# EAGLE design mcb-enhancer-v5 (EAGLE 7.2.0)
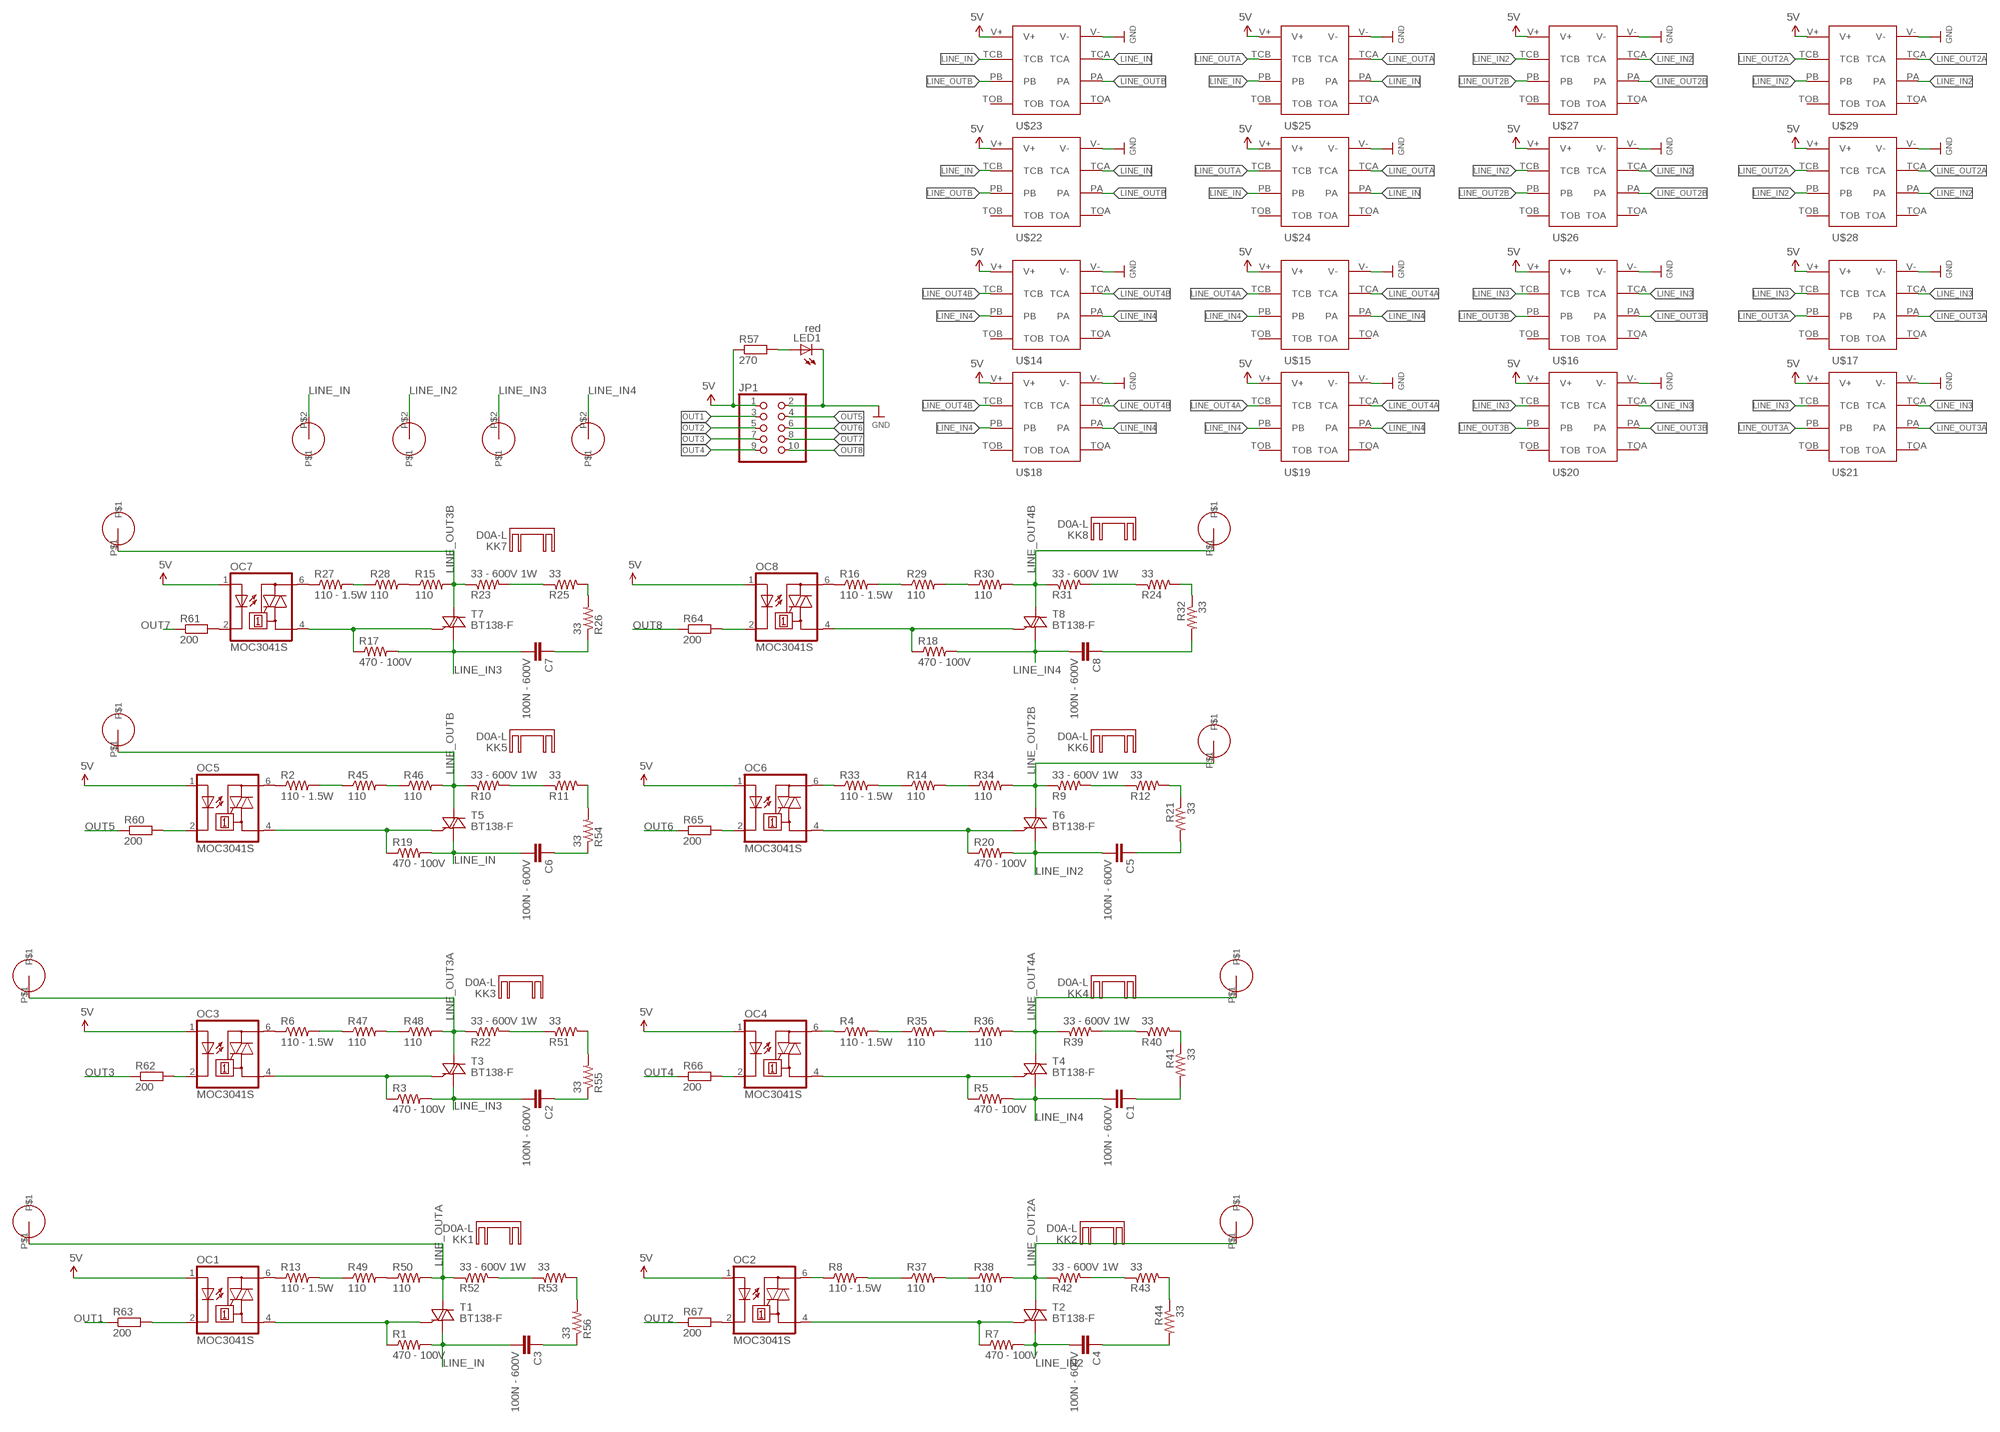
[diagram p0: schematic, sheet 1]

## Parts
C1  100N - 600V  C-EUC1210  [C1210]
C2  100N - 600V  C-EUC1210  [C1210]
C3  100N - 600V  C-EUC1210  [C1210]
C4  100N - 600V  C-EUC1210  [C1210]
C5  100N - 600V  C-EUC1210  [C1210]
C6  100N - 600V  C-EUC1210  [C1210]
C7  100N - 600V  C-EUC1210  [C1210]
C8  100N - 600V  C-EUC1210  [C1210]
JP1  PINHD-2X5  [2X05]
KK1  D0A-L  [D02A-L]
KK2  D0A-L  [D02A-L]
KK3  D0A-L  [D02A-L]
KK4  D0A-L  [D02A-L]
KK5  D0A-L  [D02A-L]
KK6  D0A-L  [D02A-L]
KK7  D0A-L  [D02A-L]
KK8  D0A-L  [D02A-L]
LED1  red  LEDCHIP-LED0805  [CHIP-LED0805]
OC1  MOC3041S  [DIL6-SMD]
OC2  MOC3041S  [DIL6-SMD]
OC3  MOC3041S  [DIL6-SMD]
OC4  MOC3041S  [DIL6-SMD]
OC5  MOC3041S  [DIL6-SMD]
OC6  MOC3041S  [DIL6-SMD]
OC7  MOC3041S  [DIL6-SMD]
OC8  MOC3041S  [DIL6-SMD]
R1  470 - 100V  R-US_R1206  [R1206]
R2  110 - 1.5W  R-US_R2512  [R2512]
R3  470 - 100V  R-US_R1206  [R1206]
R4  110 - 1.5W  R-US_R2512  [R2512]
R5  470 - 100V  R-US_R1206  [R1206]
R6  110 - 1.5W  R-US_R2512  [R2512]
R7  470 - 100V  R-US_R1206  [R1206]
R8  110 - 1.5W  R-US_R2512  [R2512]
R9  33 - 600V 1W  R-US_R1206  [R1206]
R10  33 - 600V 1W  R-US_R1206  [R1206]
R11  33  R-US_R1206  [R1206]
R12  33  R-US_R1206  [R1206]
R13  110 - 1.5W  R-US_R2512  [R2512]
R14  110  R-US_R2512  [R2512]
R15  110  R-US_R2512  [R2512]
R16  110 - 1.5W  R-US_R2512  [R2512]
R17  470 - 100V  R-US_R1206  [R1206]
R18  470 - 100V  R-US_R1206  [R1206]
R19  470 - 100V  R-US_R1206  [R1206]
R20  470 - 100V  R-US_R1206  [R1206]
R21  33  R-US_R1206  [R1206]
R22  33 - 600V 1W  R-US_R1206  [R1206]
R23  33 - 600V 1W  R-US_R1206  [R1206]
R24  33  R-US_R1206  [R1206]
R25  33  R-US_R1206  [R1206]
R26  33  R-US_R1206  [R1206]
R27  110 - 1.5W  R-US_R2512  [R2512]
R28  110  R-US_R2512  [R2512]
R29  110  R-US_R2512  [R2512]
R30  110  R-US_R2512  [R2512]
R31  33 - 600V 1W  R-US_R1206  [R1206]
R32  33  R-US_R1206  [R1206]
R33  110 - 1.5W  R-US_R2512  [R2512]
R34  110  R-US_R2512  [R2512]
R35  110  R-US_R2512  [R2512]
R36  110  R-US_R2512  [R2512]
R37  110  R-US_R2512  [R2512]
R38  110  R-US_R2512  [R2512]
R39  33 - 600V 1W  R-US_R1206  [R1206]
R40  33  R-US_R1206  [R1206]
R41  33  R-US_R1206  [R1206]
R42  33 - 600V 1W  R-US_R1206  [R1206]
R43  33  R-US_R1206  [R1206]
R44  33  R-US_R1206  [R1206]
R45  110  R-US_R2512  [R2512]
R46  110  R-US_R2512  [R2512]
R47  110  R-US_R2512  [R2512]
R48  110  R-US_R2512  [R2512]
R49  110  R-US_R2512  [R2512]
R50  110  R-US_R2512  [R2512]
R51  33  R-US_R1206  [R1206]
R52  33 - 600V 1W  R-US_R1206  [R1206]
R53  33  R-US_R1206  [R1206]
R54  33  R-US_R1206  [R1206]
R55  33  R-US_R1206  [R1206]
R56  33  R-US_R1206  [R1206]
R57  270  R-EU_R0402  [R0402]
R60  200  R-EU_R0603  [R0603]
R61  200  R-EU_R0603  [R0603]
R62  200  R-EU_R0603  [R0603]
R63  200  R-EU_R0603  [R0603]
R64  200  R-EU_R0603  [R0603]
R65  200  R-EU_R0603  [R0603]
R66  200  R-EU_R0603  [R0603]
R67  200  R-EU_R0603  [R0603]
T1  BT138-F  [TO220BF]
T2  BT138-F  [TO220BF]
T3  BT138-F  [TO220BF]
T4  BT138-F  [TO220BF]
T5  BT138-F  [TO220BF]
T6  BT138-F  [TO220BF]
T7  BT138-F  [TO220BF]
T8  BT138-F  [TO220BF]
U$1  CONN-SCREW-MINI  [CONN-SCREW-MINI]
U$2  CONN-SCREW-MINI  [CONN-SCREW-MINI]
U$3  CONN-SCREW-MINI  [CONN-SCREW-MINI]
U$4  CONN-SCREW-MINI  [CONN-SCREW-MINI]
U$5  CONN-SCREW-MINI  [CONN-SCREW-MINI]
U$6  CONN-SCREW-MINI  [CONN-SCREW-MINI]
U$7  CONN-SCREW-MINI  [CONN-SCREW-MINI]
U$8  CONN-SCREW-MINI  [CONN-SCREW-MINI]
U$9  CONN  [HC617]
U$10  CONN  [HC617]
U$11  CONN  [HC617]
U$12  CONN  [HC617]
U$14  9-1462038-9  [TE-9-1462038-9]
U$15  9-1462038-9  [TE-9-1462038-9]
U$16  9-1462038-9  [TE-9-1462038-9]
U$17  9-1462038-9  [TE-9-1462038-9]
U$18  9-1462038-9  [TE-9-1462038-9]
U$19  9-1462038-9  [TE-9-1462038-9]
U$20  9-1462038-9  [TE-9-1462038-9]
U$21  9-1462038-9  [TE-9-1462038-9]
U$22  9-1462038-9  [TE-9-1462038-9]
U$23  9-1462038-9  [TE-9-1462038-9]
U$24  9-1462038-9  [TE-9-1462038-9]
U$25  9-1462038-9  [TE-9-1462038-9]
U$26  9-1462038-9  [TE-9-1462038-9]
U$27  9-1462038-9  [TE-9-1462038-9]
U$28  9-1462038-9  [TE-9-1462038-9]
U$29  9-1462038-9  [TE-9-1462038-9]

## Nets
5V: JP1.1 OC1.1(A) OC2.1(A) OC3.1(A) OC4.1(A) OC5.1(A) OC6.1(A) OC7.1(A) OC8.1(A) R57.1 U$14.V+ U$15.V+ U$16.V+ U$17.V+ U$18.V+ U$19.V+ U$20.V+ U$21.V+ U$22.V+ U$23.V+ U$24.V+ U$25.V+ U$26.V+ U$27.V+ U$28.V+ U$29.V+
GND: JP1.2 LED1.C U$14.V- U$15.V- U$16.V- U$17.V- U$18.V- U$19.V- U$20.V- U$21.V- U$22.V- U$23.V- U$24.V- U$25.V- U$26.V- U$27.V- U$28.V- U$29.V-
LINE_IN: C3.2 C6.2 R1.2 R19.2 T1.T1(A1) T5.T1(A1) U$9.P$2 U$22.TCA U$22.TCB U$23.TCA U$23.TCB U$24.PA U$24.PB U$25.PA U$25.PB
LINE_IN2: C4.2 C5.2 R7.2 R20.2 T2.T1(A1) T6.T1(A1) U$10.P$2 U$26.TCA U$26.TCB U$27.TCA U$27.TCB U$28.PA U$28.PB U$29.PA U$29.PB
LINE_IN3: C2.2 C7.2 R3.2 R17.2 T3.T1(A1) T7.T1(A1) U$11.P$2 U$16.TCA U$16.TCB U$17.TCA U$17.TCB U$20.TCA U$20.TCB U$21.TCA U$21.TCB
LINE_IN4: C1.2 C8.2 R5.2 R18.2 T4.T1(A1) T8.T1(A1) U$12.P$2 U$14.PA U$14.PB U$15.PA U$15.PB U$18.PA U$18.PB U$19.PA U$19.PB
LINE_OUT2A: R38.2 R42.1 T2.T2(A2) U$2.P$1 U$28.TCA U$28.TCB U$29.TCA U$29.TCB
LINE_OUT2B: R9.1 R34.2 T6.T2(A2) U$6.P$1 U$26.PA U$26.PB U$27.PA U$27.PB
LINE_OUT3A: R22.1 R48.2 T3.T2(A2) U$3.P$1 U$17.PA U$17.PB U$21.PA U$21.PB
LINE_OUT3B: R15.2 R23.1 T7.T2(A2) U$7.P$1 U$16.PA U$16.PB U$20.PA U$20.PB
LINE_OUT4A: R36.2 R39.1 T4.T2(A2) U$4.P$1 U$15.TCA U$15.TCB U$19.TCA U$19.TCB
LINE_OUT4B: R30.2 R31.1 T8.T2(A2) U$8.P$1 U$14.TCA U$14.TCB U$18.TCA U$18.TCB
LINE_OUTA: R50.2 R52.1 T1.T2(A2) U$1.P$1 U$24.TCA U$24.TCB U$25.TCA U$25.TCB
LINE_OUTB: R10.1 R46.2 T5.T2(A2) U$5.P$1 U$22.PA U$22.PB U$23.PA U$23.PB
N$1: OC5.6(A2) R2.1
N$2: OC2.6(A2) R8.1
N$3: OC3.4(A1) R3.1 T3.G
N$4: OC3.6(A2) R6.1
N$5: OC4.4(A1) R5.1 T4.G
N$6: OC1.2(C) R63.2
N$7: R9.2 R12.1
N$8: R49.2 R50.1
N$9: R52.2 R53.1
N$10: OC1.6(A2) R13.1
N$11: OC1.4(A1) R1.1 T1.G
N$12: R8.2 R37.1
N$13: OC2.4(A1) R7.1 T2.G
N$14: R45.2 R46.1
N$15: OC2.2(C) R67.2
N$16: R23.2 R25.1
N$17: R25.2 R26.2
N$18: OC3.2(C) R62.2
N$19: OC4.2(C) R66.2
N$20: C7.1 R26.1
N$21: R12.2 R21.1
N$22: OC7.2(C) R61.2
N$23: OC7.6(A2) R27.1
N$24: OC8.2(C) R64.2
N$25: R15.1 R28.2
N$26: R27.2 R28.1
N$27: OC5.2(C) R60.2
N$28: OC6.2(C) R65.2
N$29: R16.2 R29.1
N$30: OC7.4(A1) R17.1 T7.G
N$31: OC8.6(A2) R16.1
N$32: OC8.4(A1) R18.1 T8.G
N$33: R29.2 R30.1
N$34: R37.2 R38.1
N$35: OC5.4(A1) R19.1 T5.G
N$36: OC6.4(A1) R20.1 T6.G
N$37: C5.1 R21.2
N$38: OC4.6(A2) R4.1
N$39: C8.1 R32.2
N$40: R24.2 R32.1
N$41: R24.1 R31.2
N$42: R4.2 R35.1
N$43: R35.2 R36.1
N$44: OC6.6(A2) R33.1
N$45: R14.1 R33.2
N$46: R14.2 R34.1
N$47: R39.2 R40.1
N$48: C1.1 R41.2
N$49: R40.2 R41.1
N$50: C4.1 R44.2
N$51: R43.2 R44.1
N$52: R42.2 R43.1
N$53: R47.2 R48.1
N$54: R13.2 R49.1
N$55: R6.2 R47.1
N$56: R2.2 R45.1
N$57: R22.2 R51.1
N$58: R10.2 R11.1
N$59: C3.1 R56.1
N$60: R53.2 R56.2
N$61: C2.1 R55.1
N$62: R51.2 R55.2
N$63: C6.1 R54.1
N$64: R11.2 R54.2
N$65: LED1.A R57.2
OUT1: JP1.3 R63.1
OUT2: JP1.5 R67.1
OUT3: JP1.7 R62.1
OUT4: JP1.9 R66.1
OUT5: JP1.4 R60.1
OUT6: JP1.6 R65.1
OUT7: JP1.8 R61.1
OUT8: JP1.10 R64.1
Unconnected: U$14.TOA U$14.TOB U$15.TOA U$15.TOB U$16.TOA U$16.TOB U$17.TOA U$17.TOB U$18.TOA U$18.TOB U$19.TOA U$19.TOB U$20.TOA U$20.TOB U$21.TOA U$21.TOB U$22.TOA U$22.TOB U$23.TOA U$23.TOB U$24.TOA U$24.TOB U$25.TOA U$25.TOB U$26.TOA U$26.TOB U$27.TOA U$27.TOB U$28.TOA U$28.TOB U$29.TOA U$29.TOB

## Library data of the parts
C1-C8 = rcl:C-EU: CAPACITOR, European symbol
JP1 = pinhead:PINHD-2X5: PIN HEADER
KK1-KK8 = heatsink:D0A-L: HEATSINK distributor Schukat
LED1 = adafruit:LED: LED OSRAM: - CHIPLED LG R971, LG N971, LY N971, LG Q971, LY Q971, LO R971, LY R971 LH N974, LH R974 LS Q976, LO Q976, LY Q976 LO Q996 - Hyper CHIPLED LW Q18S LB Q993, LB Q99A, LB R99A - SideLED LS A670, LO A670, LY A670, LG A670, LP A670 LB A673, LV A673, LT A673, LW A673 LH A674 LY A675 LS A676, LA A676, LO A676, LY A676, LW A676 LS A679, LY A679, LG A679 - Hyper Micro SIDELED® LS Y876, LA Y876, LO Y876, LY Y876 LT Y87S - SmartLED LW L88C, LW L88S LB L89C, LB L89S, LG L890 LS L89K, LO L89K, LY L89K LS L896, LA L896, LO L896, LY L896 - TOPLED LS T670, LO T670, LY T670, LG T670, LP T670 LSG T670, LSP T670, LSY T670, LOP T670, LYG T670 LG T671, LOG T671, LSG T671 LB T673, LV T673, LT T673, LW T673 LH T674 LS T676, LA T676, LO T676, LY T676, LB T676, LH T676, LSB T676, LW T676 LB T67C, LV T67C, LT T67C, LS T67K, LO T67K, LY T67K, LW E67C LS E67B, LA E67B, LO E67B, LY E67B, LB E67C, LV E67C, LT E67C LW T67C LS T679, LY T679, LG T679 LS T770, LO T770, LY T770, LG T770, LP T770 LB T773, LV T773, LT T773, LW T773 LH T774 LS E675, LA E675, LY E675, LS T675 LS T776, LA T776, LO T776, LY T776, LB T776 LHGB T686 LT T68C, LB T68C - Hyper Mini TOPLED® LB M676 - Mini TOPLED Santana® LG M470 LS M47K, LO M47K, LY M47K Source: http://www.osram.convergy.de/
OC1-OC8 = optocoupler:MOC30*: 6-Pin DIP Zero-Cross Optoisolators Triac Driver Output (250/400 Volt Peak) Source: http://www.fairchildsemi.com/ds/MO/MOC3043-M.pdf; MF: FAIRCHILD SEMICONDUCTOR; MPN: MOC3033S-M; OC_FARNELL: unknown; OC_NEWARK: 05C2878
R1-R56 = rcl:R-US_: RESISTOR, American symbol
R57 = resistor:R-EU_: RESISTOR, European symbol
R60-R67 = rcl:R-EU_: RESISTOR, European symbol
T1-T8 = triac:BT138: TRIAC Source: http://www.semiconductors.philips.com BT138_SERIES_2.pdf
U$1-U$8 = bontor:CONN-SCREW-MINI
U$9-U$12 = bontor:CONN
U$14-U$29 = bontor:9-1462038-9

## Board
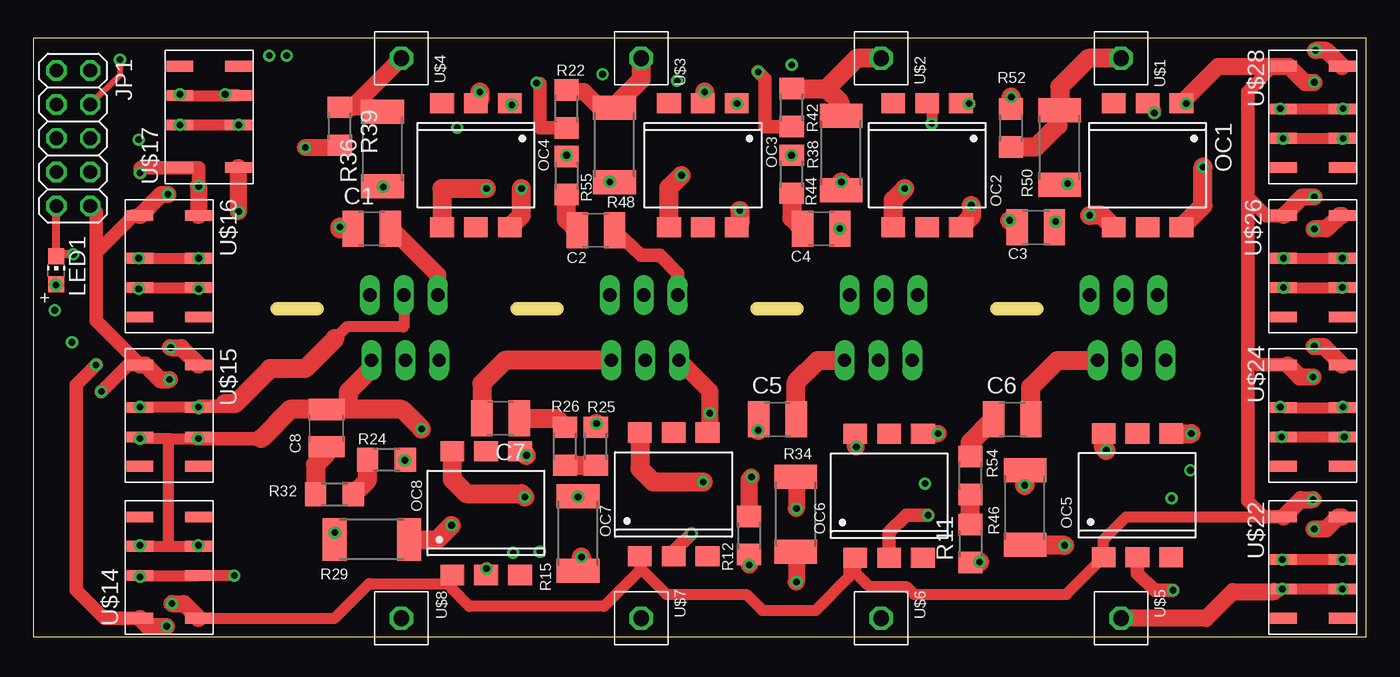
[diagram p1: board, top side]
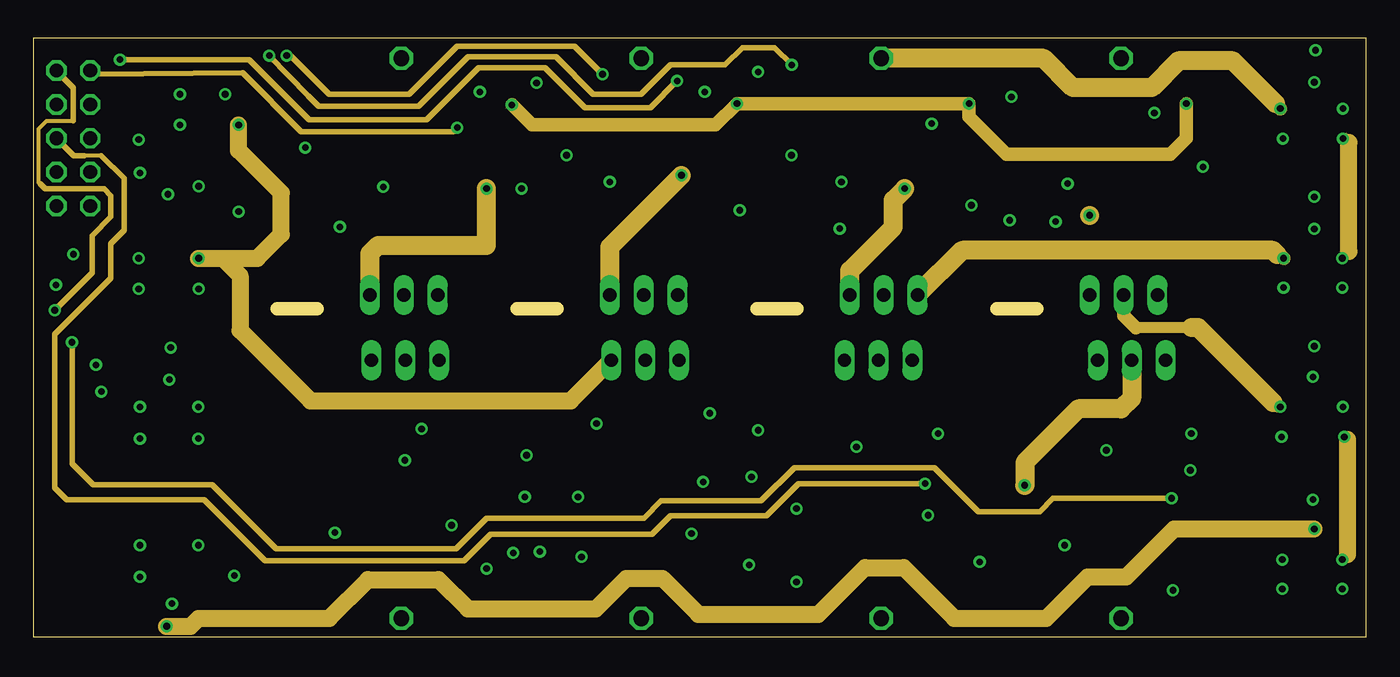
[diagram p2: board, inner layer Route2]
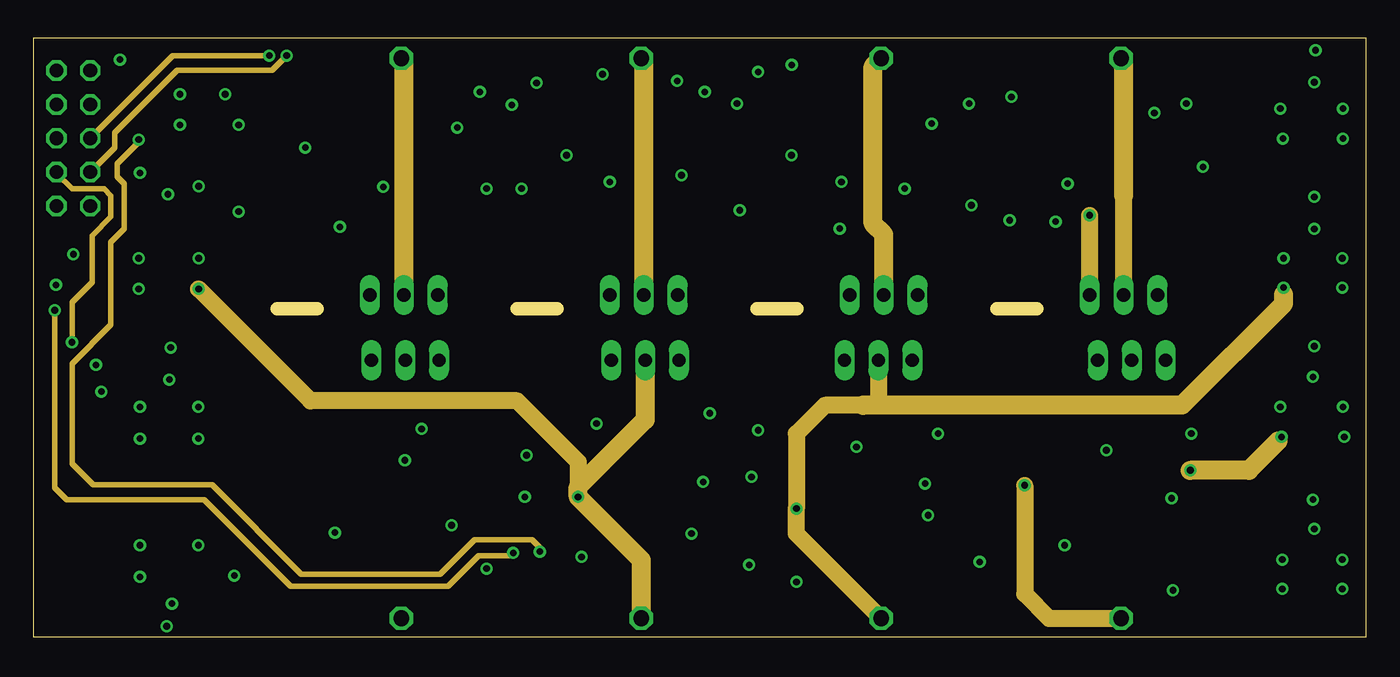
[diagram p3: board, inner layer Route15]
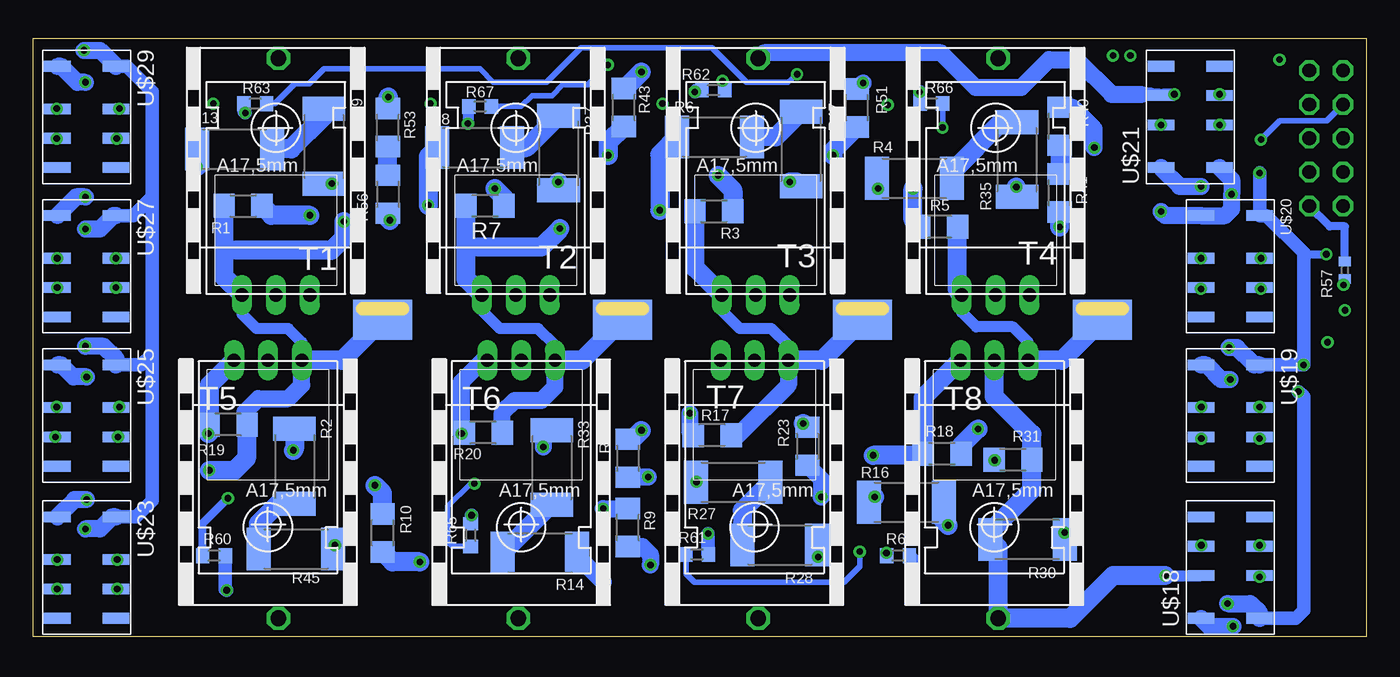
[diagram p4: board, bottom side, seen from below]

Size 100 x 44.9 mm. Coordinates in mm from the lower left corner, seen from the top.
Outline: 0,0 100,0 100,44.9 0,44.9 0,0
Copper layers (1*2+15*16): Top 0.035mm / dielectric 1.5mm / Route2 0.035mm / dielectric 0.15mm / Route15 0.035mm / dielectric 0.2mm / Bottom 0.035mm
Design rules "default *": minimum track width 10mil, minimum drill 15mil, track to track 8mil, track to pad 8mil, pad to pad 8mil, via to via 8mil, smd to smd 8mil, copper to edge 40mil, drill to drill 8mil, minimum pad ring 10mil, minimum via ring 8mil, stop-mask expansion 4mil, vias tented up to drill 0mil, thermal gap 10mil

### Footprints (pad centres in the part's own frame; a part is rotated, then mirrored left to right if it is on the bottom)
C1210 = smd 1.6 x 2.7: 1 -1.4,0; 2 1.4,0
2X05 = drill 1.016 octagon: 1 -5.08,-1.27; 2 -5.08,1.27; 3 -2.54,-1.27; 4 -2.54,1.27; 5 0,-1.27; 6 0,1.27; 7 2.54,-1.27; 8 2.54,1.27; 9 5.08,-1.27; 10 5.08,1.27
CHIP-LED0805 = smd 1.2 x 1.2: A 0,-1.05; C 0,1.05
DIL6-SMD = smd 1.78 x 1.52: 1 -2.54,-4.645; 2 0,-4.645; 3 2.54,-4.645; 4 2.54,4.645; 5 0,4.645; 6 -2.54,4.645
R1206 = smd 1.6 x 1.803: 1 -1.422,0; 2 1.422,0
R2512 = smd 1.8 x 3.2: 1 -2.8,0; 2 2.8,0
R0402 = smd 0.7 x 0.9: 1 -0.65,0; 2 0.65,0
R0603 = smd 1 x 1.1: 1 -0.85,0; 2 0.85,0
TO220BF = drill 1 pad 1.1 long: G 2.54,-1.35; T1 -2.54,-1.35; T2 0,-1.35
CONN-SCREW-MINI = drill 1.17 octagon: P$1 0,0
HC617 = smd 4.4 x 3: P$2 0,-0.8
TE-9-1462038-9 = smd 0.8 x 2: PA 1.6,2.2; PB 1.6,-2.2; TCA -0.6,2.2; TCB -0.6,-2.2; TOA 3.8,2.2; TOB 3.8,-2.2; V+ -3.8,-2.2; V- -3.8,2.2

### Placement (x,y rotation side)
C1  25.39,30.61 0 top
C2  42.2,30.51 0 top
C3  75.21,30.71 0 top
C4  59.12,30.61 0 top
C5  55.83,16.31 0 top
C6  73.44,16.31 0 top
C7  35.05,16.39 180 top
C8  21.99,15.66 90 top
JP1  3,37.4 90 top
KK1  63.8,32.7 270 bottom
KK2  81.8,32.7 270 bottom
KK3  45.8,32.7 270 bottom
KK4  27.8,32.7 270 bottom
KK5  82.4,13.9 90 bottom
KK6  63.4,13.9 90 bottom
KK7  45.9,13.9 90 bottom
KK8  27.9,13.9 90 bottom
LED1  1.7,27.5 0 top
OC1  83.59,35.38 180 top
OC2  67.06,35.38 180 top
OC3  50.23,35.38 180 top
OC4  33.2,35.38 180 top
OC5  82.83,10.62 0 top
OC6  64.21,10.59 0 top
OC7  48.04,10.69 0 top
OC8  33.97,9.29 0 top
R1  84.26,32.33 180 bottom
R2  80.4,12.8 270 bottom
R3  48.94,31.93 180 bottom
R4  33.9,34.4 0 bottom
R5  32.08,30.77 0 bottom
R6  48.9,37.5 0 bottom
R7  66.12,32.35 180 bottom
R8  66.9,36.7 0 bottom
R9  55.4,8.2 270 bottom
R10  73.8,7.8 270 bottom
R11  70.3,7 90 top
R12  53.7,7.6 90 top
R13  84.9,36.6 0 bottom
R14  62,6.3 0 bottom
R15  40.87,7.76 90 top
R16  34.5,10.1 0 bottom
R17  49.06,15.13 0 bottom
R18  31.82,13.73 0 bottom
R19  85.38,15.93 0 bottom
R20  66.24,15.33 0 bottom
R21  55.4,13.4 90 bottom
R22  40,39.6 270 top
R23  41.91,14.3 90 bottom
R24  26.5,13.3 180 top
R25  42.2,14.3 270 top
R26  39.9,14.3 270 top
R27  47.5,11.6 0 bottom
R28  44,6.9 0 bottom
R29  25.4,7.3 180 top
R30  25.4,7.3 180 bottom
R31  26.5,13.3 180 bottom
R32  22.6,10.7 180 top
R33  61.1,12.7 270 bottom
R34  57.2,9.2 90 top
R35  26.2,35.8 270 bottom
R36  26.2,36.6 90 top
R37  60.6,36.3 270 bottom
R38  60.6,36.3 90 top
R39  23,38.3 270 top
R40  23,38.3 270 bottom
R41  23,33.3 270 bottom
R42  56.9,39.7 270 top
R43  55.7,39.7 270 bottom
R44  56.9,34.7 270 top
R45  80.3,6.6 0 bottom
R46  74.4,9.7 90 top
R47  42.4,36.6 270 bottom
R48  43.6,36.9 90 top
R49  78.2,36.8 270 bottom
R50  77,36.7 90 top
R51  38.2,39.67 270 bottom
R52  73.35,38.17 90 top
R53  73.4,38.2 270 bottom
R54  70.3,12.1 270 top
R55  40,34.6 90 top
R56  73.4,33.2 90 bottom
R57  1.6,27.5 270 bottom
R60  86.44,6.09 0 bottom
R61  50.2,6.19 0 bottom
R62  48.98,41.01 180 bottom
R63  83.34,39.99 180 bottom
R64  35.12,6.09 0 bottom
R65  67.19,7.64 90 bottom
R66  32.62,40.01 180 bottom
R67  66.48,39.79 180 bottom
T1  81.8,27 0 bottom
T2  63.8,27 0 bottom
T3  45.8,27 0 bottom
T4  27.8,27 0 bottom
T5  82.4,19.4 180 bottom
T6  63.4,19.4 180 bottom
T7  45.9,19.4 180 bottom
T8  27.9,19.4 180 bottom
U$1  81.6,43.4 180 top
U$2  63.6,43.4 180 top
U$3  45.6,43.4 180 top
U$4  27.6,43.4 180 top
U$5  81.6,1.4 0 top
U$6  63.6,1.4 0 top
U$7  45.6,1.4 0 top
U$8  27.6,1.4 0 top
U$9  73.8,24.6 0 bottom
U$10  55.8,24.6 0 bottom
U$11  37.8,24.6 0 bottom
U$12  19.8,24.6 0 bottom
U$14  10.2,5.2 90 top
U$15  10.2,16.6 270 top
U$16  10.2,27.8 270 top
U$17  13.2,39 90 top
U$18  10.2,5.2 90 bottom
U$19  10.2,16.6 270 bottom
U$20  10.2,27.8 270 bottom
U$21  13.2,39 90 bottom
U$22  96,5.2 270 top
U$23  96,5.2 270 bottom
U$24  96,16.6 270 top
U$25  96,16.6 270 bottom
U$26  96,27.8 270 top
U$27  96,27.8 270 bottom
U$28  96,39 270 top
U$29  96,39 270 bottom

### Tracks (layer width: path | path; a pad name or v marks a point on that pad's centre or on a via)
5V  (via drill 0.5)
  Top 0.813: U$14.V+ 22.6,1.4 25.2,4 31.4,4 | 31.4,4 31.9,4.5 31.57,4.5 OC8.1 | 31.4,4 31.4,3.6 32.7,2.3 42.8,2.3 45.5,5 OC7.1 45.5,5.2 47.5,3.2 53.5,3.2 54.7,2 58.7,2 61.2,4.5 61.2,5.6 61.55,5.95 OC6.1 61.67,4.83 62.7,3.8 65.5,3.8 66.1,3.2 77.52,3.2 OC5.1 80.29,7.29 82,9 U$22.V+
  Top 1.016: OC1.1 86.47,40.02 v86.5,40 | v52.8,40 OC3.1 | v70.2,40 69.62,40 OC2.1 | v35.9,39.9 35.87,39.9 OC4.1 | U$28.V+ 93,42.8 91.1,40.9 91.1,33 | 91.1,33 92.5,31.6 U$26.V+ | 91.1,21.2 91.9,20.4 U$24.V+ 94.1,20.4 | 91.1,21.2 91.1,33 | U$22.V+ 92.3,9 91.1,10.2 91.1,21.2 | v5.1,18.4 7.1,20.4 U$15.V+ | U$15.V+ 7.2,20.4 | 4.7,28.8 4.7,23.7 U$15.V+ | 4.7,28.8 7.5,31.6 U$16.V+ | 4.7,28.8 4.7,31.89 JP1.1
  Top 1.27: v15.4,31.9 U$17.V+ | v10.4,2.5 11.3,2.5 U$14.V+ | U$15.V+ 8.4,20.4 9.5,19.3 v10.2,19.3 | U$16.V+ 9.6,33.2 v10.1,33.2 | v96.1,41.6 95.4,41.6 94.2,42.8 U$28.V+ 88.91,42.8 OC1.1 | U$26.V+ 95.2,33 v96.1,33 | 94.1,20.4 95,19.5 v96,19.5 | v96,10.3 95.1,10.3 U$22.V+
  Route2 1.016: v35.9,39.9 37.4,38.4 51.2,38.4 v52.8,40 v70.2,40 70.2,39 73,36.2 85.3,36.2 86.5,37.4 v86.5,40
  Bottom 0.61: R57.1 1.6,30.8 2.75,30.8 JP1.1 4.27,32.17
  Bottom 1.016: U$18.V+ 5.3,1.4 4.7,2 4.7,18 v5.1,18.4
  Bottom 1.27: U$21.V+ 10.1,34.3 v10.1,33.2 10.1,32.1 10.6,31.6 U$20.V+ 15.1,31.6 v15.4,31.9 | v10.2,19.3 10.9,19.3 12,20.4 U$19.V+ | v96.1,41.6 96.7,41.6 97.9,42.8 U$29.V+ | v96.1,33 96.8,33 U$27.V+ | v96,19.5 97,19.5 97.9,20.4 U$25.V+ | v96,10.3 96.9,10.3 U$23.V+ | v10.4,2.5 8.7,2.5 8,1.8 U$18.V+
GND  (via drill 0.5)
  Top 0.61: JP1.2 1.73,28.58 LED1.C 1.85,28.7 v3,28.7
  Top 1.016: U$14.V- 5.3,1.4 3.2,3.5 3.2,18.9 v4.7,20.4 | v8,34.8 8,35.2 U$17.V- 12.4,35.2 v12.4,33.8
  Top 1.27: v12.4,33.8 U$16.V- | U$14.V- 8.6,0.8 v10,0.8 | v10.3,21.7 11.1,21.7 U$15.V- | U$28.V- 97,44 v96.2,44 | U$26.V- 98,31.6 97,30.6 v96.1,30.6 | v96.1,21.8 96.8,21.8 U$24.V- | v96.1,8.1 97,8.1 97.9,9 U$22.V-
  Route2 1.27: v10,0.8 11.8,0.8 U$18.V- 22.2,1.4 25.1,4.3 30.4,4.3 32.6,2.1 42.2,2.1 44.5,4.4 47.2,4.4 49.9,1.7 58.9,1.7 62.4,5.2 65.3,5.2 69.1,1.4 76,1.4 79.1,4.5 82,4.5 85.6,8.1 v96.1,8.1
  Bottom 0.61: 4.7,28.8 4.6,28.7 v3,28.7
  Bottom 1.016: U$27.V- 92.5,31.6 91.1,33 | 91.1,33 91.1,40.9 93,42.8 U$29.V- | 93.8,20.9 93.3,20.4 91.9,20.4 91.1,21.2 | 91.1,21.2 91.1,33 | 94.1,9 92.3,9 91.1,10.2 91.1,21.2 | U$19.V- v4.7,20.4 4.7,28.8 7.5,31.6 U$20.V- v8,34.8
  Bottom 1.27: U$21.V- 14,33.8 v12.4,33.8 | U$19.V- 8.4,20.4 9.7,21.7 v10.3,21.7 | v96.2,44 95,44 U$29.V- | v96.1,30.6 95,30.6 94,31.6 U$27.V- | v96.1,21.8 94.7,21.8 93.8,20.9 U$25.V- | U$23.V- 94.1,9 95,8.1 v96.1,8.1 | U$18.V- 11.8,0.8 v10,0.8
LINE_IN  (via drill 0.5)
  Top 0.813: v93.65,15 93.75,15.05 U$25.PA U$24.PA 98.25,15.05 v98.35,15 | U$23.TCA v93.7,5.8 U$22.TCA
  Top 1.422: C3.2 76.65,30.75 v76.7,31.15 | C6.2 74.84,18.74 76.85,20.75 T5.T1
  Route2 0.813: 98.6,14.8 98.4,15 v98.35,15 | 98.6,6.2 U$22.TCA
  Route2 1.27: 98.6,6.2 98.6,14.8
  Route15 0.813: v93.65,15 93.4,14.75 93.4,14.7
  Route15 1.422: 93.4,14.7 91.2,12.5 v86.8,12.5
  Bottom 0.813: T5.T1 79.86,22.11 80.88,23.12 83.25,23.12 84.34,24.21 T1.T1 | U$25.PA 93.75,15.05 v93.65,15 | U$24.PA 98.25,15.05 v98.35,15 | U$23.TCA v93.7,5.8
  Bottom 1.016: 84.12,16.1 R19.2
  Bottom 1.27: 84.12,16.1 84.12,16.88 83.12,17.88 80.88,17.88 79.86,18.89 T5.T1
  Bottom 1.422: U$9.P$2 76.85,20.75 T5.T1 | T1.T1 85.68,26.99 85.68,29 | 85.68,29 R1.2 | 85.68,29 77.62,29 76.7,29.93 v76.7,31.15 | R19.2 84,15.89 84,13.4 84.9,12.5 v86.8,12.5
  other vias: 98.2,5.8
LINE_IN2  (via drill 0.5)
  Top 0.813: v93.75,37.38 93.8,37.33 U$29.PA 98.25,37.4 v98.25,37.38 98.2,37.33 U$28.PA | U$26.TCB U$26.TCA
  Top 1.422: v60.5,30.62 60.5,30.61 C4.2 | C5.2 57.23,19.13 58.85,20.75 T6.T1
  Route2 0.813: U$26.TCA 98.7,28.9 | 98.7,37.1 98.42,37.38 v98.25,37.38
  Route2 1.016: U$26.TCB 93.5,28.7 93.3,28.7
  Route2 1.27: 98.7,28.9 98.7,37.1
  Route2 1.422: 93.3,28.7 93,29 69.69,29 T2.T1
  Bottom 0.813: T6.T1 60.86,21.86 62.12,23.12 65,23.12 66.34,24.46 T2.T1 | U$29.PA 93.75,37.33 v93.75,37.38 | U$28.PA 98.25,37.33 v98.25,37.38
  Bottom 1.27: R20.2 64.82,16.81 63.88,17.75 61.88,17.75 60.88,18.75 60.88,20.73 T6.T1
  Bottom 1.422: U$10.P$2 58.85,20.75 T6.T1 | 67.54,29.25 R7.2 | 67.54,29.25 67.54,26.85 T2.T1 | 67.54,29.25 61.88,29.25 v60.5,30.62
  other vias: 98.2,28.4 93.8,28.4
LINE_IN3  (via drill 0.5)
  Top 0.813: v7.9,28.4 U$20.TCA U$20.TCB | U$21.TCB U$21.TCA
  Top 1.016: C2.2 45.59,28.62 47,28.62 48.34,27.29 T3.T1
  Top 1.422: T7.T1 35.38,20.75 33.65,19.02 C7.2
  Route2 1.27: T7.T1 40.31,17.7 20.8,17.7 15.5,23 15.5,27.1 14.2,28.4 U$20.TCB 16.8,28.4 18.6,30.2 18.6,33.3 15.4,36.5 U$21.TCA
  Bottom 0.813: T7.T1 43.36,21.86 44.62,23.12 47,23.12 48.34,24.46 T3.T1 | U$20.TCA v7.9,28.4
  Bottom 1.27: T7.T1 43.36,18.89 47.12,15.13 R17.2
  Bottom 1.422: U$11.P$2 40.85,20.75 T7.T1 | T3.T1 50.36,27.67 R3.2
  other vias: 11,38.4 15.4,38.4 12.4,28.4
LINE_IN4  (via drill 0.5)
  Top 0.813: 10.25,14.88 v8,14.88 U$19.PA | v8,6.88 U$14.PA 10.12,6.8 | v12.38,6.88 12.38,6.8 U$14.PB 10.12,6.8 | U$15.PA 12.28,14.88 | 10.25,14.88 10.12,14.75 10.12,6.8 | 10.25,14.88 v12.38,14.88
  Top 1.016: 12.28,14.88 v12.38,14.88 17.07,14.88
  Top 1.27: C1.2 26.89,30.61 30.34,27.16 T4.T1
  Top 1.422: 23.12,17.06 22.5,17.06 C8.2 19.26,17.06 17.07,14.88 | T8.T1 25.36,20.11 23.62,18.38 23.62,17.56 23.12,17.06 | v29.12,15.6 27.66,17.06 23.12,17.06
  Bottom 0.813: T8.T1 25.36,22.11 26.5,23.25 29.25,23.25 30.34,24.34 T4.T1 | U$19.PA v8,14.88 | 12.38,14.97 U$15.PA 12.4,14.88 v12.38,14.88 | U$14.PA v8,6.88 | U$14.PB 12.4,6.88 v12.38,6.88
  Bottom 1.422: U$12.P$2 22.85,20.75 T8.T1 | T4.T1 30.66,25.97 R5.2 | R18.2 30.4,14.33 v29.12,15.6
LINE_OUT2A  (via drill 0.5)
  Top 0.813: v93.55,39.62 93.8,39.58 U$29.TCA U$28.TCA 98.2,39.58 v98.25,39.62
  Top 1.422: R42.1 59.5,41.12 | 59.5,41.12 60.5,40.12 60.5,39.2 R38.2 | U$2.P$1 61.78,43.4 59.5,41.12
  Route2 1.016: v93.55,39.62 93.2,39.98 93.2,40
  Route2 1.422: 93.2,40 90,43.2 85.9,43.2 83.9,41.2 78,41.2 75.8,43.4 U$2.P$1
  Route15 1.422: T2.T2 63.8,30.2 63,31 63,42.8 U$2.P$1
  Bottom 0.813: U$29.TCA 93.75,39.65 v93.55,39.62 | U$28.TCA 98.25,39.65 v98.25,39.62
LINE_OUT2B  (via drill 0.5)
  Top 0.813: U$26.PB U$26.PA
  Top 1.27: R34.2 57.25,11.95 v57.25,9.62
  Route15 0.813: 93.8,25.7 U$26.PB
  Route15 1.27: T6.T2 63.4,17.6 63.2,17.4 | 62.25,17.38 59.38,17.38 57.25,15.25 v57.25,9.62 57.25,7.75 U$6.P$1
  Route15 1.422: 62.25,17.38 62.27,17.4 63.2,17.4 86.2,17.4 93.8,25 93.8,25.7
  Bottom 1.27: v57.25,9.62 R9.1
  other vias: 93.8,26.2 98.2,26.2
LINE_OUT3A  (via drill 0.5)
  Top 0.813: v11,40.7 U$21.PB U$21.PA 15.3,40.7 v14.4,40.7
  Top 1.27: R48.2 43.41,39.89 43,39.89 42.31,39.89 41.3,40.9 40,40.9 R22.1
  Top 1.422: U$3.P$1 45.6,41.8 43.69,39.89 43,39.89
  Route15 1.422: T3.T2 45.8,43.4 U$3.P$1
  Bottom 0.813: U$21.PB v11,40.7 | 16.2,40.7 15.5,40.7 U$21.PA 15.3,40.7 v14.4,40.7
  Bottom 1.016: 16.2,40.7 16.9,40.7 17.4,40.7
  Bottom 1.27: U$3.P$1 45.2,43.8 31.9,43.8 29.3,41.2 25.9,41.2 23.8,43.3 21.7,43.3 19.1,40.7 16.9,40.7
LINE_OUT3B  (via drill 0.5)
  Top 0.813: v7.9,26.1 U$20.PA U$20.PB v12.4,26.1
  Top 1.27: v40.88,10.5 v40.87,10.51 R15.2
  Route15 1.27: v40.87,10.51 40.87,13.13 36.3,17.7 20.8,17.7 v12.4,26.1
  Route15 1.422: T7.T2 45.9,16.27 40.88,11.25 v40.88,10.5 | v40.87,10.51 45.6,5.78 U$7.P$1
  Bottom 0.813: U$20.PA v7.9,26.1 | U$20.PB v12.4,26.1
  Bottom 1.27: R23.1 40.88,11.84 v40.88,10.5
LINE_OUT4A  (via drill 0.5)
  Top 0.813: v8,17.25 U$19.TCA 8.05,17.25 v12.38,17.25 12.38,17.23 U$15.TCA | T4.T2 27.8,23.3 27.75,23.25 23.5,23.25 22.62,22.38
  Top 1.016: 14.38,17.5 14.18,17.3 12.5,17.3 U$15.TCA
  Top 1.27: U$4.P$1 23.92,39.72 R39.1 25.38,39.72 R36.2
  Top 1.422: 22.62,22.38 20.38,20.12 17.75,20.12 15.12,17.5 14.38,17.5
  Route15 1.422: T4.T2 27.8,43.4 U$4.P$1
  Bottom 0.813: U$19.TCA v8,17.25 | U$15.TCA 12.38,17.23 v12.38,17.25
LINE_OUT4B  (via drill 0.5)
  Top 0.813: v8,4.5 U$14.TCA U$14.TCB | v15.07,4.6 U$14.TCB | 12.38,4.6 U$14.TCB
  Bottom 0.813: U$14.TCA v8,4.5 | v15.07,4.6 U$14.TCB
  Bottom 1.422: T8.T2 27.9,18.02 25.08,15.2 R31.1 25.08,11.05 28.2,7.92 R30.2 27.6,6.7 U$8.P$1 22.2,1.4 19,4.6 v15.07,4.6
LINE_OUTA  (via drill 0.5)
  Top 0.813: v93.55,17.25 U$25.TCA U$24.TCA v98.25,17.25
  Top 1.422: R52.1 75.25,36.75 76.88,38.38 76.88,39.38 R50.2 77,41.25 79.15,43.4 U$1.P$1
  Route2 0.813: v93.55,17.25 93.35,17.25 93,17.6 | 86.9,23.2 82.7,23.2
  Route2 1.016: 82.7,23.2 81.8,24.1 T1.T2
  Route2 1.422: 93,17.6 87.4,23.2 86.9,23.2
  Route15 1.27: T1.T2 81.8,33.1
  Route15 1.422: 81.8,33.1 81.8,43.2 U$1.P$1
  Bottom 0.813: U$25.TCA v93.55,17.25 | U$24.TCA v98.25,17.25
LINE_OUTB  (via drill 0.5)
  Top 0.813: 93.1,3.4 93.5,3.4 v93.7,3.6 U$22.PB U$22.PA
  Top 1.27: U$5.P$1 88,1.4 90,3.4 93.1,3.4
  Top 1.422: v74.38,11.38 74.4,11.4 R46.2
  Route2 1.422: T5.T2 82.4,17.9 81.6,17.1 78.4,17.1 74.4,13.1 74.4,11.4 v74.38,11.38
  Route15 1.27: v74.38,11.38 74.38,3.23 76.2,1.4 U$5.P$1
  Bottom 0.813: U$22.PB v93.7,3.6
  Bottom 1.422: R10.1 73.8,10.8 v74.38,11.38
  other vias: 98.2,3.6
N$1  (via drill 0.5)
  Top 1.422: v80.5,14 80.29,14.21 OC5.6
  Bottom 1.422: R2.1 80.4,14.1 v80.5,14
N$2  (via drill 0.5)
  Top 1.422: v70.38,32.38 70.38,31.51 OC2.6
  Bottom 1.422: R8.1 70.38,36.02 v70.38,32.38
N$3  (via drill 0.5)
  Top 1.422: OC3.4 47.69,33.69 v48.62,34.62
  Route2 1.422: T3.G 43.26,29.26 v48.62,34.62
  Bottom 1.422: v48.62,34.62 47.52,33.52 R3.1
N$4  (via drill 0.5)
  Top 1.422: v53,32 53,30.96 OC3.6
  Bottom 1.422: R6.1 53,36.2 v53,32
N$5  (via drill 0.5)
  Top 1.422: v34,33.62 30.66,33.62 OC4.4
  Route2 1.422: T4.G 25.26,28.76 25.88,29.38 34,29.38 v34,33.62
  Bottom 1.422: R5.1 34,31.27 v34,33.62
N$6  (via drill 0.5)
  Top 1.016: OC1.2 84.1,39.52 v84.1,39.3
  Bottom 1.016: v84.1,39.3 84.19,39.39 R63.2
N$7  (via drill 0.5)
  Top 1.27: v53.7,5.4 R12.1
  Bottom 1.27: R9.2 54.3,6.78 R12.1 v53.7,5.4
N$8  (via drill 0.5)
  Top 1.422: R50.1 77.1,34 v77.6,34
  Bottom 1.422: v77.6,34 R49.2
N$9  (via drill 0.5)
  Top 1.422: v73.38,40.5 73.38,39.62 R52.2
  Bottom 1.422: R53.1 73.4,40.48 v73.38,40.5
N$10  (via drill 0.5)
  Top 1.422: OC1.6 87.75,32.35 v87.75,35.25
  Bottom 1.422: v87.75,35.25 87.7,35.3 R13.1
N$11  (via drill 0.5)
  Top 1.422: OC1.4 80.16,31.62 v79.25,31.62
  Route2 1.422: v79.26,31.61 v79.25,31.62
  Route15 1.27: T1.G v79.25,31.62
  Route15 1.422: T1.G
  Bottom 1.422: v79.25,31.62 82.13,31.62 R1.1
N$12
  Bottom 1.422: R8.2 63,36.7 R37.1
N$13  (via drill 0.5)
  Top 1.422: OC2.4 64.52,32.77 v65.38,33.62
  Route2 1.422: T2.G 61.26,27.48 OC2.4 64.52,32.77 v65.38,33.62
  Bottom 1.422: v65.38,33.62 64.7,32.95 R7.1
N$14  (via drill 0.5)
  Top 1.422: v77.38,6.88 74.42,6.88 R46.1
  Bottom 1.422: R45.2 77.5,6.75 v77.38,6.88
N$15  (via drill 0.5)
  Top 0.813: OC2.2 67.4,39.69 v67.4,38.5
  Bottom 0.813: v67.4,38.5 67.33,38.57 R67.2
N$16  (via drill 0.5)
  Top 1.422: R25.1 42.25,15.77 v42.25,16
  Bottom 1.422: v42.25,16 41.97,15.72 R23.2
N$17
  Top 1.422: R26.2 R25.2
N$18  (via drill 0.5)
  Top 1.422: OC3.2 50.38,40.17 v50.38,40.88
  Bottom 1.016: v50.38,40.88 50.24,41.01 R62.2
N$19  (via drill 0.5)
  Top 1.422: v33.5,40.88 33.5,40.33 OC4.2
  Bottom 1.016: R66.2 33.5,40.04 v33.5,40.88
N$20
  Top 1.422: C7.1 39.23,16.39 R26.1
N$21  (via drill 0.5)
  Top 1.27: v53.88,12 53.7,11.82 R12.2
  Bottom 1.27: R21.1 55.38,12 v53.88,12
N$22  (via drill 0.5)
  Top 1.016: v49.38,7.75 48.04,6.42 OC7.2
  Bottom 1.016: R61.2 49.38,6.21 v49.38,7.75
N$23  (via drill 0.5)
  Top 1.422: OC7.6 45.5,12.62 46.5,11.62 v50.25,11.62
  Bottom 1.422: v50.25,11.62 50.27,11.6 R27.1
N$24  (via drill 0.5)
  Top 1.016: v34,5.12 33.97,5.09 OC8.2
  Bottom 1.016: R64.2 34,5.82 v34,5.12
N$25  (via drill 0.5)
  Top 1.422: v41.12,6 41.12,5.21 R15.1
  Bottom 1.422: R28.2 41.12,6.83 v41.12,6
N$26
  Bottom 1.422: R27.2 46.8,9.5 R28.1
N$27  (via drill 0.5)
  Top 1.016: OC5.2 82.83,4.79 84.12,3.5 v85.5,3.5
  Bottom 1.016: v85.5,3.5 85.59,3.59 R60.2
N$28  (via drill 0.5)
  Top 1.016: v67.12,9.12 65.5,9.12 64.21,7.83 OC6.2
  Bottom 1.016: R65.2 67.12,8.55 v67.12,9.12
N$29  (via drill 0.5)
  Top 1.422: R29.1 30.3,7.3 v31.38,8.38
  Bottom 1.422: v31.38,8.38 31.7,8.7 R16.2
N$30  (via drill 0.5)
  Top 1.27: OC7.4 50.75,15.51 v50.75,16.77 50.75,18.44 T7.G
  Bottom 1.27: R17.1 50.75,15.4 v50.75,16.77
N$31  (via drill 0.5)
  Top 1.422: OC8.6 31.43,11.82 32.5,10.75 36.62,10.75 v36.88,10.5
  Bottom 1.422: v36.88,10.5 36.9,10.5 R16.1
N$32  (via drill 0.5)
  Top 1.422: v37,13.62 36.69,13.94 OC8.4
  Bottom 1.422: T8.G 33.24,17.95 R18.1 33.35,13.62 v37,13.62
N$33  (via drill 0.5)
  Top 1.422: R30.1 22.62,7.28 v22.62,7.83
  Bottom 1.422: v22.62,7.83 22.6,6.65 R30.1
N$34  (via drill 0.5)
  Top 1.422: R37.2 60.6,34.1 v60.62,34.12
  Bottom 1.422: v60.62,34.12 60.62,33.52 R37.2
N$35  (via drill 0.5)
  Top 1.422: OC5.4 85.39,15.25 v86.88,15.25
  Bottom 1.422: T5.G 86.8,18.89 86.8,16.75 R19.1 86.8,15.32 v86.88,15.25
N$36  (via drill 0.5)
  Top 1.27: OC6.4 67.77,15.25 v67.88,15.25
  Bottom 1.27: R20.1 67.88,15.54 v67.88,15.25 67.88,19.12 66.25,20.75 T6.G
N$37  (via drill 0.5)
  Top 1.422: C5.1 54.38,16.25 v54.38,15.5
  Bottom 1.422: v54.38,15.5 55.05,14.82 R21.2
N$38  (via drill 0.5)
  Top 1.422: OC4.6 36.62,31.62 v36.62,33.62
  Bottom 1.422: v36.62,33.62 36.7,33.7 R4.1
N$39
  Top 1.422: C8.1 21.99,13.74 21.18,12.93 R32.2
N$40
  Top 1.422: R32.1 25.08,11.76 R24.2
N$41  (via drill 0.5)
  Top 1.422: v27.88,13.25 27.92,13.25 R24.1
  Bottom 1.422: R24.1 27.92,13.25 v27.88,13.25
N$42
  Bottom 1.422: R35.1 27.4,38.6 31.1,34.9 R4.2
N$43  (via drill 0.5)
  Top 1.422: v26.25,33.75 26.2,33.88 R36.1
  Bottom 1.422: R35.2 26.25,33 v26.25,33.75
N$44  (via drill 0.5)
  Top 1.27: v61.75,14.25 61.67,14.33 OC6.6
  Bottom 1.27: R33.1 61.75,14.85 v61.75,14.25
N$45
  Bottom 1.422: R33.2 61.2,9.9 R14.1
N$46  (via drill 0.5)
  Top 1.27: R34.1 57.25,6.35 v57.25,4.12
  Bottom 1.27: v57.25,4.12 59.2,6.08 R14.2
N$47  (via drill 0.5)
  Top 1.27: R39.2 22.82,36.7 v20.4,36.7
  Top 1.422: R39.2
  Bottom 1.27: v20.4,36.7 20.4,38.1 22.02,39.72 R40.1
N$48  (via drill 0.5)
  Top 1.422: C1.1 23,30.61 v23,30.75
  Bottom 1.422: v23,30.75 R41.2
N$49
  Bottom 1.422: R40.2 R41.1
N$50
  Top 1.422: R44.2 56.9,31.43 C4.1
N$51  (via drill 0.5)
  Top 1.422: v56.88,36.12 56.9,36.15 R44.1
  Bottom 1.422: R43.2 56.88,37.1 v56.88,36.12
N$52  (via drill 0.5)
  Top 1.016: R42.2 54.88,38.28 54.88,41.88 v54.38,42.38
  Bottom 1.422: v54.38,42.38 55.63,41.12 R43.1
N$53  (via drill 0.5)
  Top 1.422: R48.1 43.27,34.1 v43.25,34.12
  Bottom 1.422: v43.25,34.12 42.73,34.12 R47.2
N$54
  Bottom 1.422: R49.1 78.2,39.05 80.65,36.6 R13.2
N$55
  Bottom 1.422: R47.1 44.3,37.5 R6.2
N$56
  Bottom 1.422: R45.1 83.1,8.53 81.62,10 R2.2
N$57  (via drill 0.5)
  Top 0.813: 38,41.5 37.8,41.5 v37.75,41.55
  Top 1.016: R22.2 38,38.18 38,41.5
  Bottom 1.27: v37.75,41.55 R51.1
N$58  (via drill 0.5)
  Top 1.422: R11.1 70.35,5.62 v71,5.62
  Bottom 1.422: v71,5.62 73.05,5.62 R10.2
N$59  (via drill 0.5)
  Top 1.422: v73.25,31.25 73.27,31.25 C3.1
  Bottom 1.422: R56.1 73.4,31.4 v73.25,31.25
N$60
  Bottom 1.422: R56.2 R53.2
N$61
  Top 1.422: R55.1 40,31.31 C2.1
N$62  (via drill 0.5)
  Top 1.422: v40,36.12 R55.2
  Bottom 1.422: R51.2 40,36.45 v40,36.12
N$63
  Top 1.422: R54.1 70.3,14.57 C6.1
N$64
  Top 1.422: R11.2 R54.2
N$65  (via drill 0.5)
  Top 0.61: v1.7,26.4 LED1.A
  Bottom 0.61: R57.2 1.7,26.75 v1.7,26.4
OUT1  (via drill 0.5)
  Route2 0.406: v42.7,42.2 40.6,44.3 31.8,44.3 28.2,40.7 22.2,40.7 19.3,43.6 v19,43.6
  Route15 0.406: JP1.3 6.1,36.69 6.1,37.8 10.8,42.5 17.9,42.5 v19,43.6
  Bottom 0.406: R63.1 81.91,39.99 80.4,41.5 79.3,41.5 78.2,42.6 66.5,42.6 65.5,41.6 61.5,41.6 58.9,44.2 49.1,44.2 46.5,41.6 43.4,41.6 42.9,42 v42.7,42.2
OUT2  (via drill 0.5)
  Route2 0.406: v17.7,43.6 20.6,40.6 21.4,39.8 28.9,39.8 32.6,43.5 39.2,43.5 42,40.7 45.6,40.7 47.8,42.9 51.9,42.9 53.2,44.2 55.6,44.2 v56.9,42.9
  Route15 0.406: v17.7,43.6 10.47,43.6 JP1.5
  Bottom 0.406: R67.1 63.41,39.79 62.6,40.6 61.1,40.6 60.3,41.4 58.4,41.4 v56.9,42.9
OUT3  (via drill 0.5)
  Top 0.406: v6.5,43.3 6.5,42.17 JP1.7
  Route2 0.406: v48.3,41.7 46.3,39.7 41.4,39.7 38.4,42.7 33.4,42.7 29.5,38.8 20.7,38.8 16.2,43.3 v6.5,43.3
  Bottom 0.406: R62.1 48.13,41.67 v48.3,41.7
OUT4  (via drill 0.5)
  Route2 0.406: 4.35,42.4 JP1.9 4.55,42.2 15.7,42.3 20.1,37.9 31.5,37.9 v31.8,38.2
  Bottom 0.406: R66.1 31.77,38.23 v31.8,38.2
OUT5  (via drill 0.5)
  Route2 0.406: v85.4,10.4 76.5,10.4 75.5,9.4 70.9,9.4 67.6,12.7 57.1,12.7 54.6,10.2 47.1,10.2 45.8,8.9 34,8.9 31.7,6.6 18.2,6.6 13.4,11.4 4.5,11.4 2.9,13 v2.9,22.1
  Route15 0.406: v2.9,22.1 2.9,25.1 4.4,26.6 4.4,30.1 5.8,31.5 5.8,33.1 5.3,33.6 2.9,33.6 1.73,34.77 JP1.4
  Bottom 0.61: R60.1 87.29,8.51 v85.4,10.4
OUT6  (via drill 0.5)
  Route2 0.305: 5.1,36.1 3.8,36.1
  Route2 0.406: v66.9,11.5 57.4,11.5 55,9.1 47.8,9.1 46.4,7.7 34.3,7.7 32.3,5.7 17.4,5.7 12.8,10.3 2.5,10.3 1.6,11.2 1.6,22.7 5.8,26.9 5.8,29.5 6.8,30.5 6.8,34.4 5.1,36.1 | 3.8,36.1 3.03,36.1 JP1.6
  Bottom 0.406: R65.1 68.59,6.79 68.9,7.1 68.9,9.8 67.2,11.5 v66.9,11.5
OUT7  (via drill 0.5)
  Route15 0.406: v38,6.4 38,6.7 37.4,7.3 33.1,7.3 30.5,4.7 20.1,4.7 13.4,11.4 4.5,11.4 2.9,13 2.9,20.5 5.8,23.4 5.8,29.6 6.8,30.6 6.8,34 6.3,34.5 6.3,35.5 7.9,37.1 v7.9,37.3
  Bottom 0.406: R61.1 51.05,4.75 50.4,4.1 39.2,4.1 38,5.3 v38,6.4 | v7.9,37.3 6.5,38.7 2.97,38.7 JP1.8
OUT8  (via drill 0.5)
  Route2 0.305: 0.5,34 0.4,34.1 0.4,38.1 1,38.7 3,38.7
  Route2 0.406: v1.6,24.5 4.4,27.3 4.4,30.1 5.8,31.5 5.8,33.1 5.3,33.6 0.9,33.6 0.5,34 | JP1.10 3.01,41.2 3.01,38.71 3,38.7
  Route15 0.406: v36,6.3 35.8,6.1 33.4,6.1 31.1,3.8 19.3,3.8 12.8,10.3 2.5,10.3 1.6,11.2 v1.6,24.5
  Bottom 0.61: R64.1 36,6.12 v36,6.3